# EAGLE schematic headstage-64_bga (EAGLE 8.3.2)
DESIGNER: JON NEWMAN, JAKOB VOIGTS, JACK ZHANG; LICENSE: CC-BY-SA-4.0; REVISION: 1.0
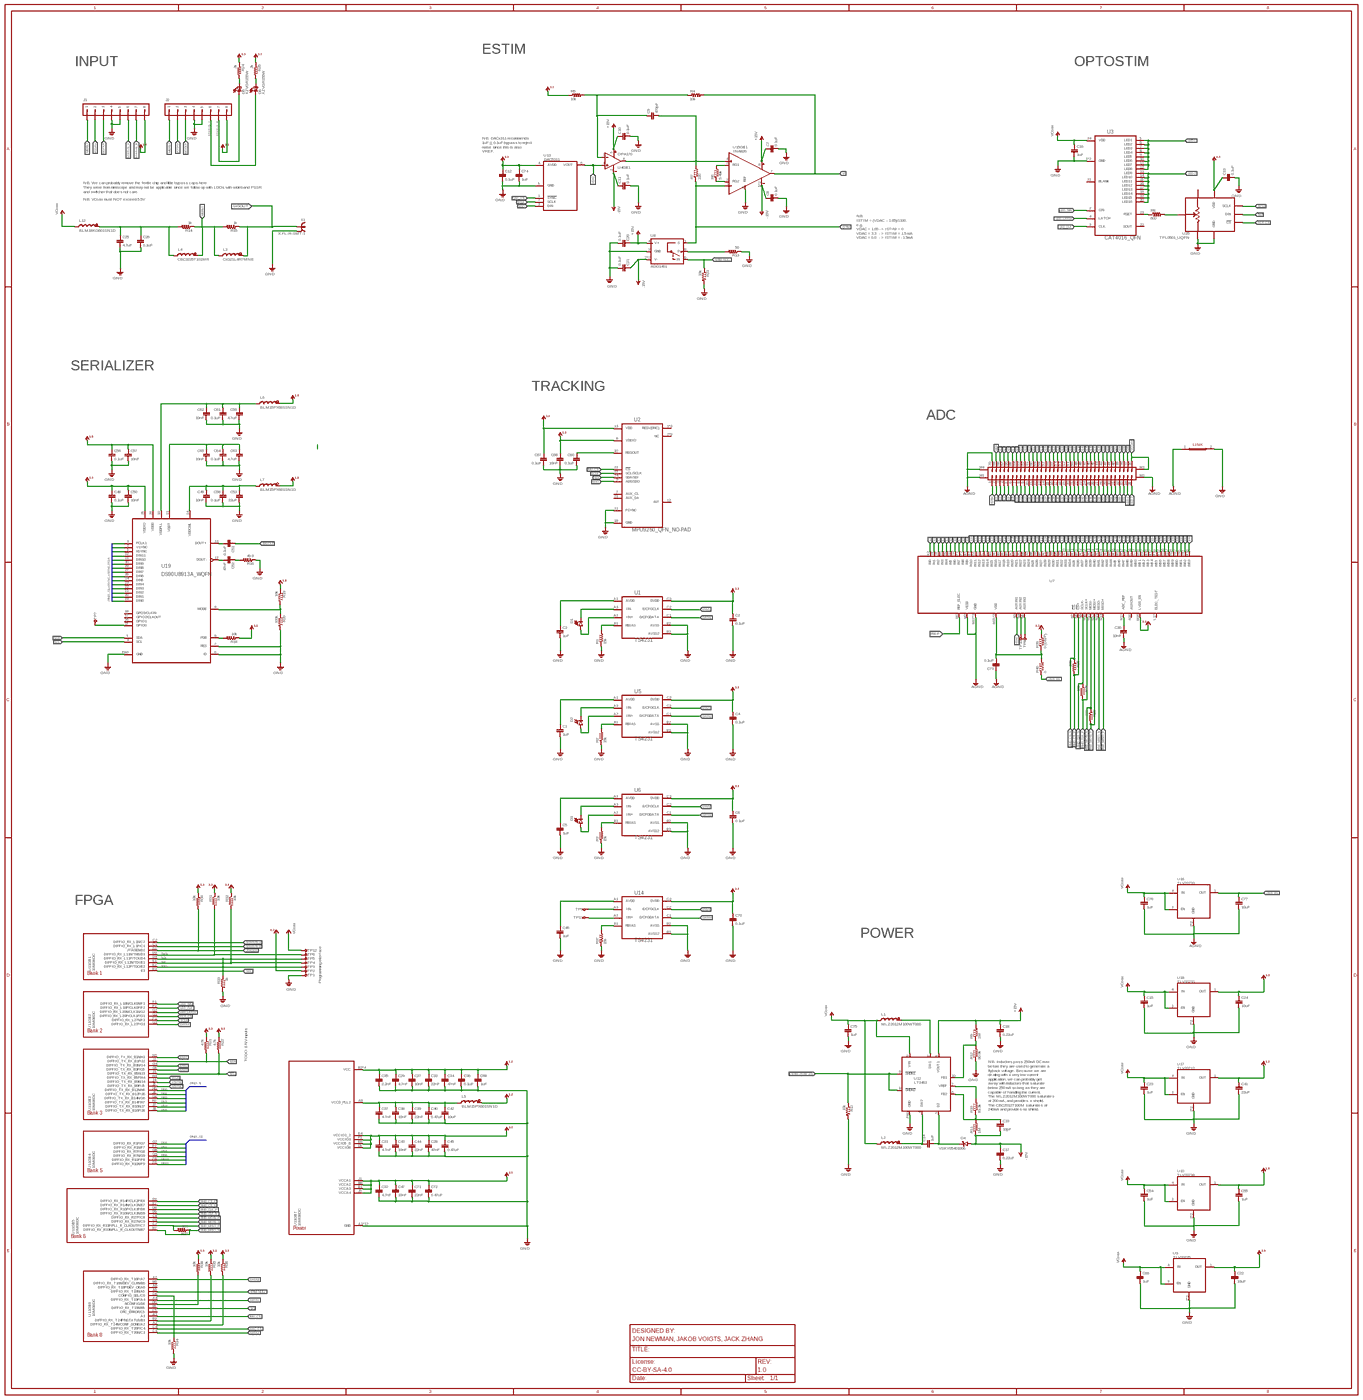
[diagram p0: schematic, sheet 1, overview]
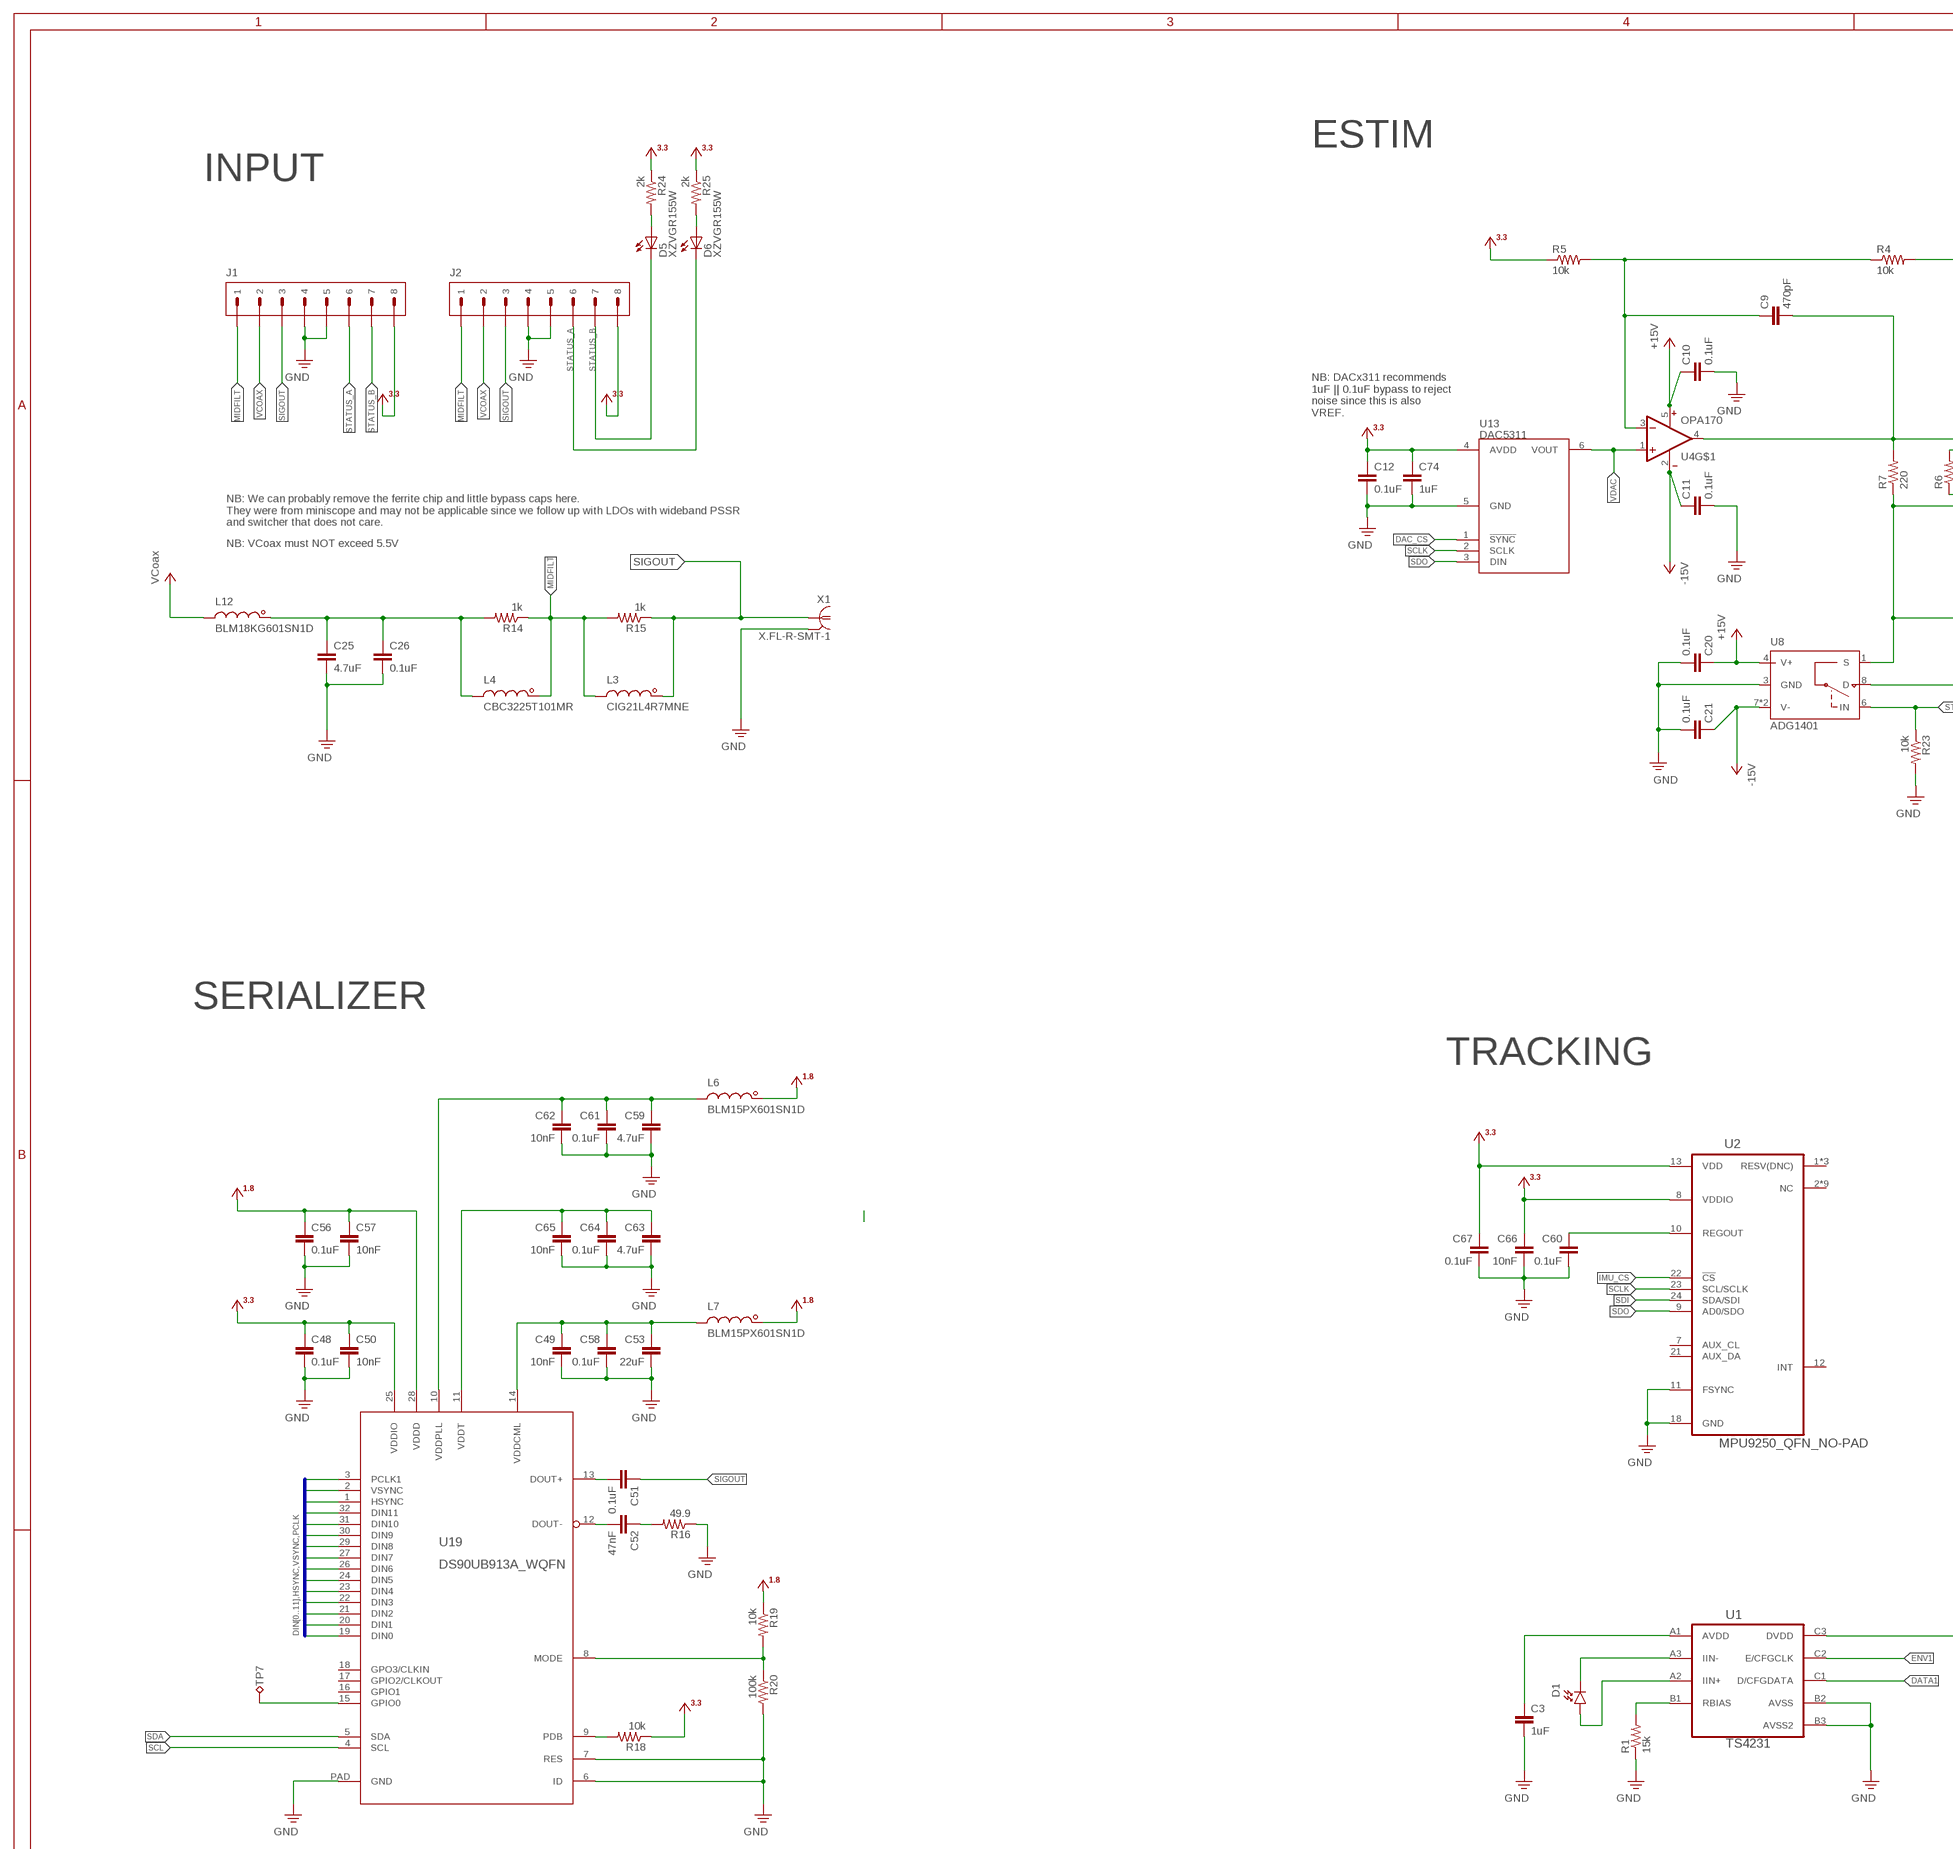
[diagram p1: schematic, sheet 1, part 1 of 4]
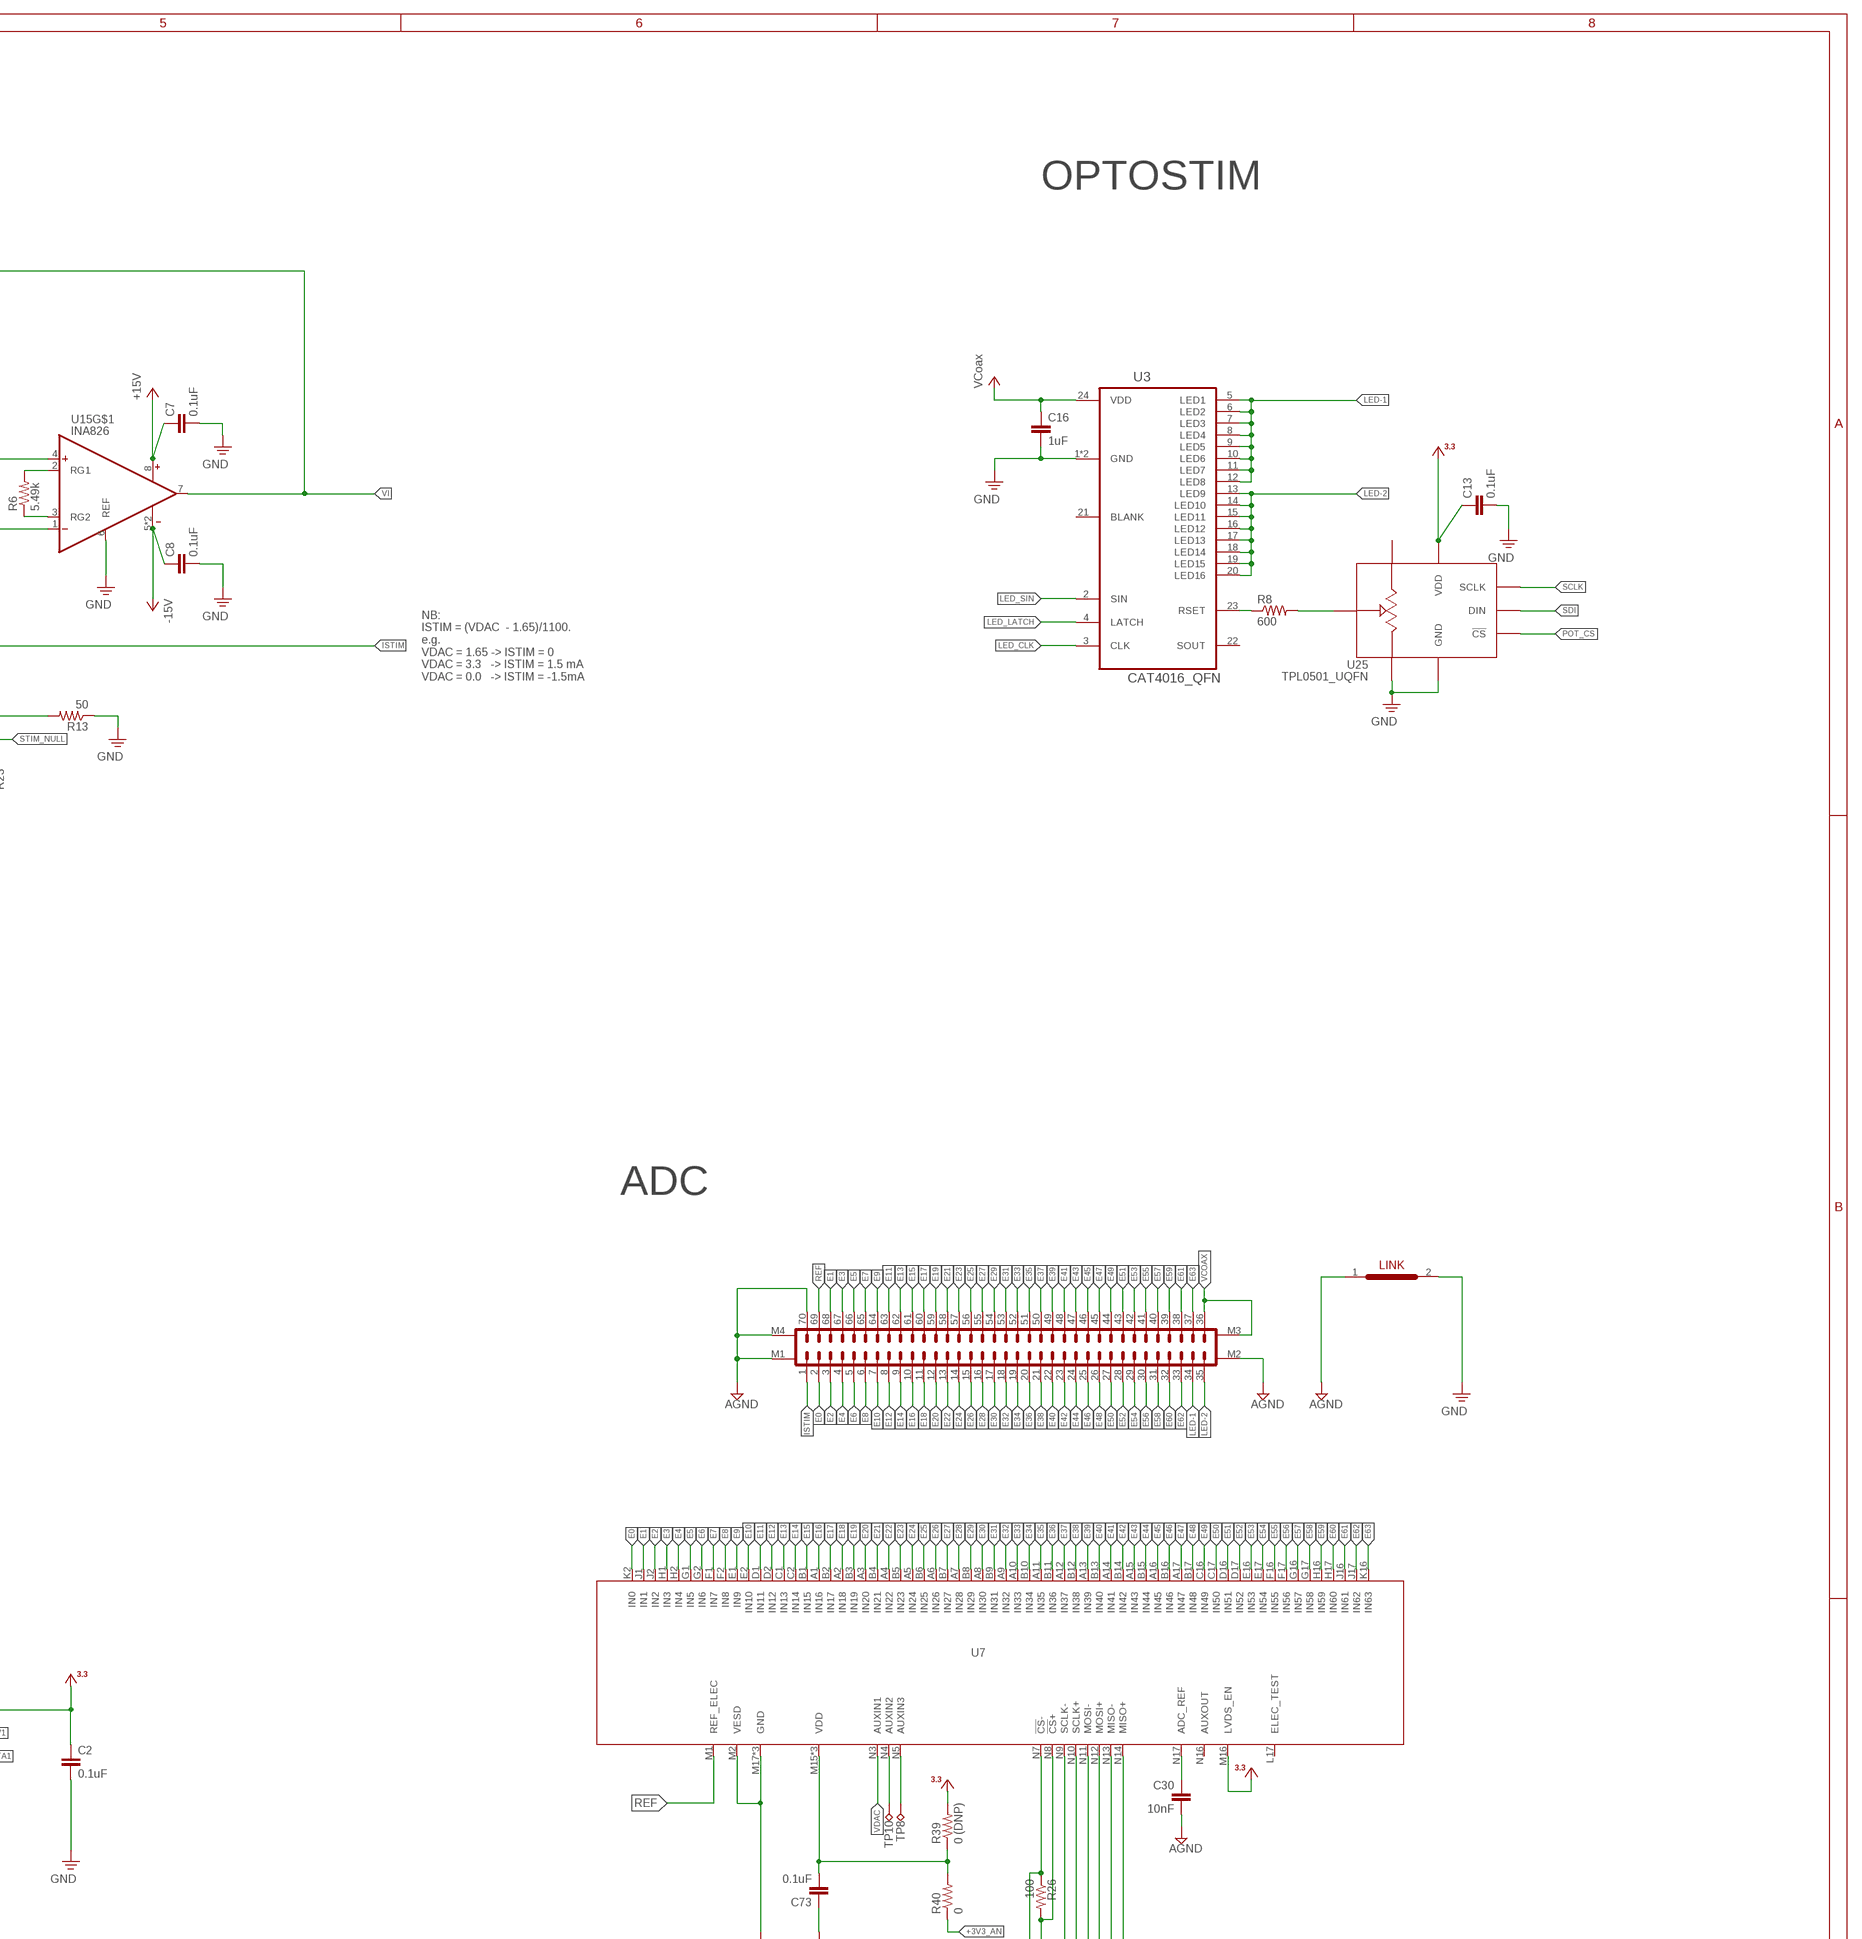
[diagram p2: schematic, sheet 1, part 2 of 4]
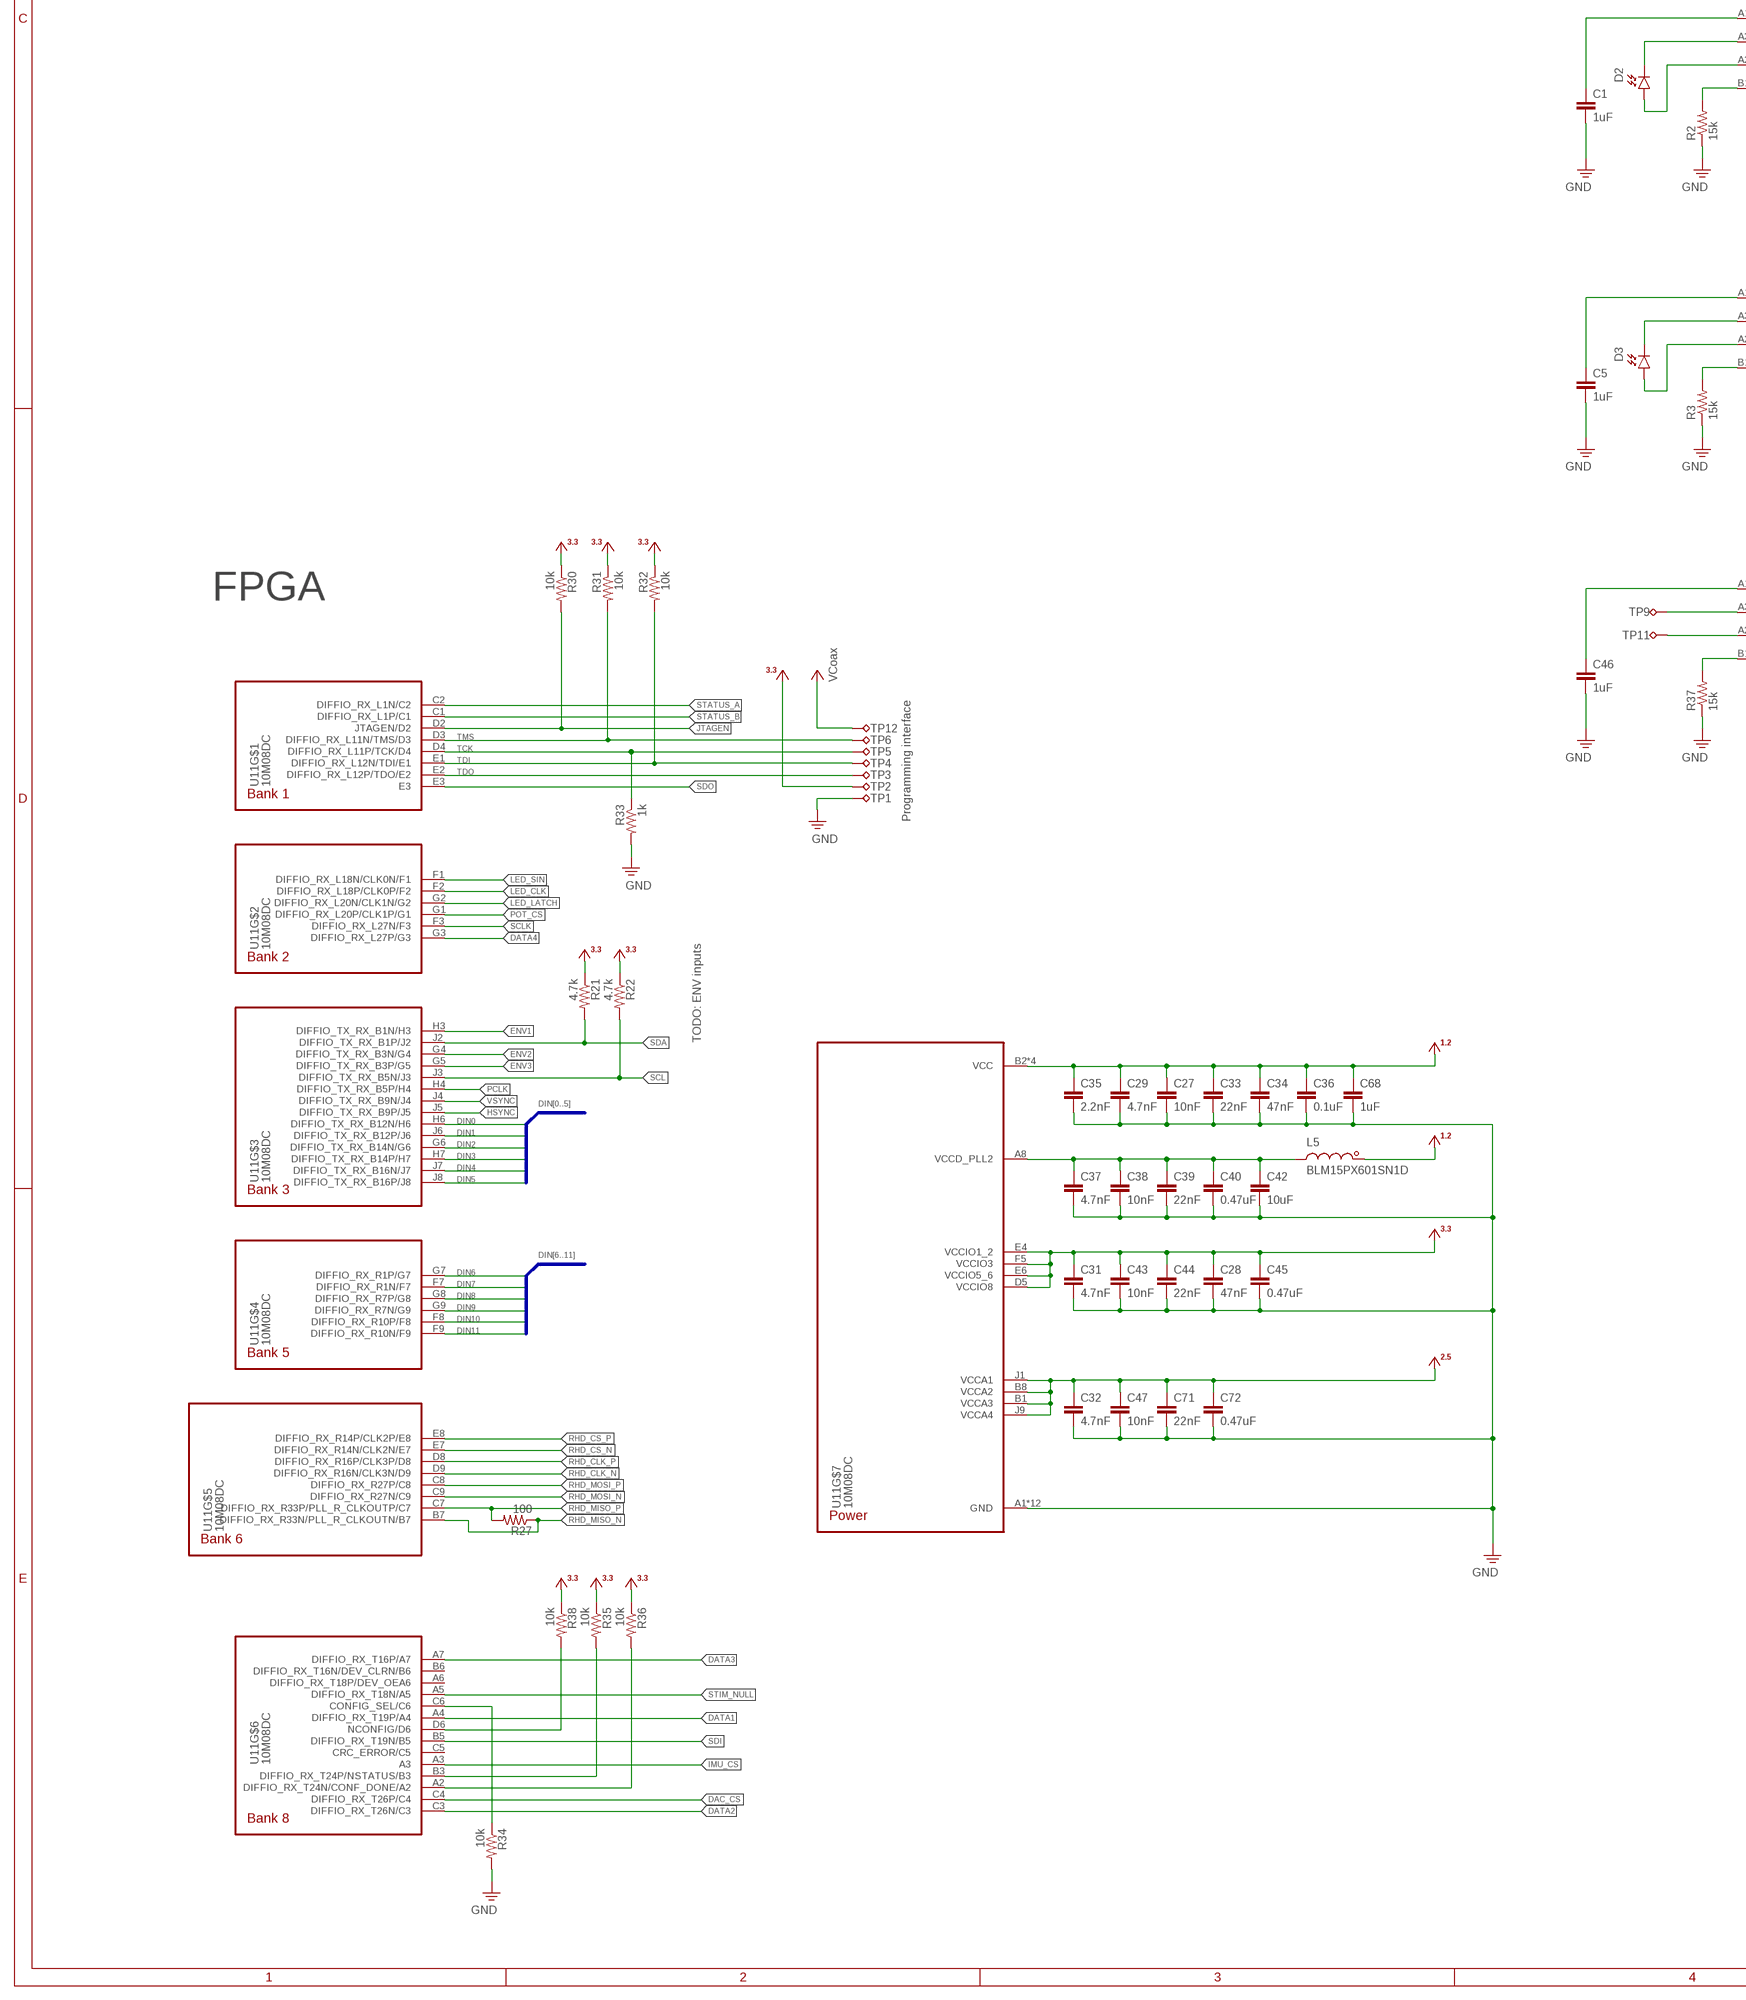
[diagram p3: schematic, sheet 1, part 3 of 4]
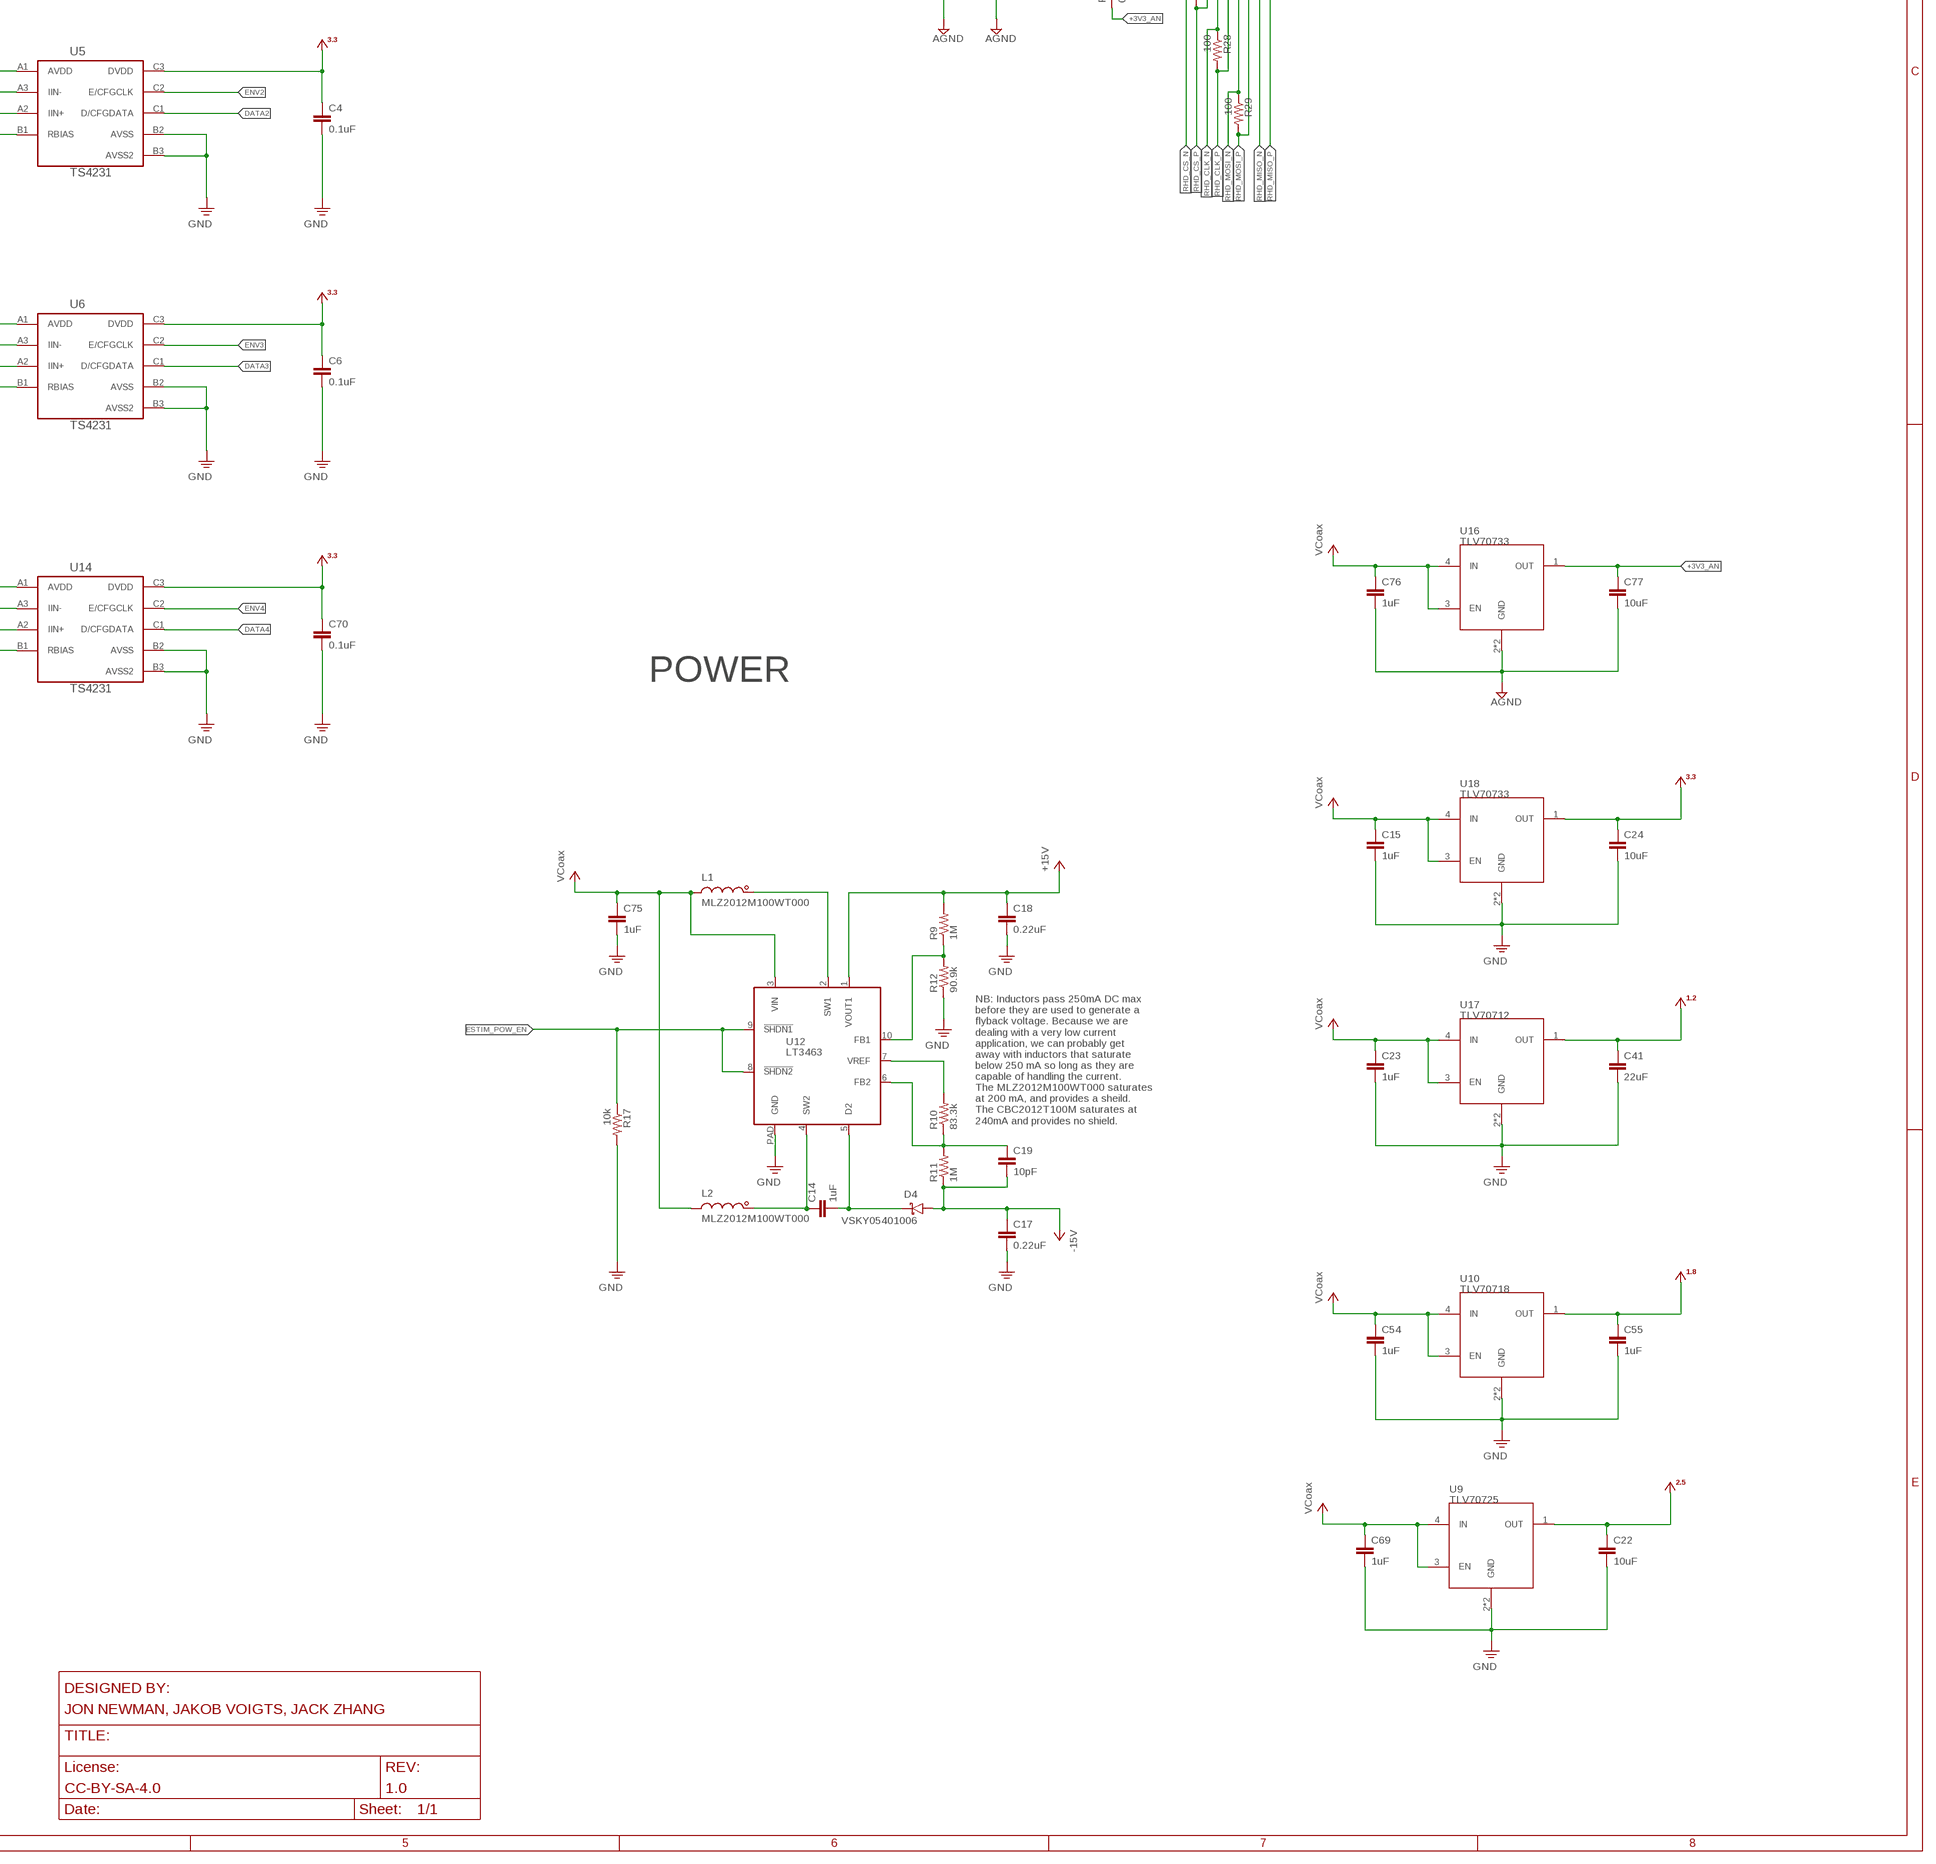
[diagram p4: schematic, sheet 1, part 4 of 4]

## Parts
C1  1uF  C_0201T  [0201T]
C2  0.1uF  C_0201T  [0201T]
C3  1uF  C_0201T  [0201T]
C4  0.1uF  C_0201T  [0201T]
C5  1uF  C_0201T  [0201T]
C6  0.1uF  C_0201T  [0201T]
C7  0.1uF  C_0201T  [0201T]
C8  0.1uF  C_0201T  [0201T]
C9  470pF  C_0201T  [0201T]
C10  0.1uF  C_0201T  [0201T]
C11  0.1uF  C_0201T  [0201T]
C12  0.1uF  C_0201T  [0201T]
C13  0.1uF  C_0201T  [0201T]
C14  1uF  C_0402T  [0402T]
C15  1uF  C_0402T  [0402T]
C16  1uF  C_0402T  [0402T]
C17  0.22uF  C_0402T  [0402T]
C18  0.22uF  C_0402T  [0402T]
C19  10pF  C_0201T  [0201T]
C20  0.1uF  C_0201T  [0201T]
C21  0.1uF  C_0201T  [0201T]
C22  10uF  C_0402T  [0402T]
C23  1uF  C_0402T  [0402T]
C24  10uF  C_0402T  [0402T]
C25  4.7uF  C_0402T  [0402T]
C26  0.1uF  C_0402T  [0402T]
C27  10nF  C_0201T  [0201T]
C28  47nF  C_0201T  [0201T]
C29  4.7nF  C_0201T  [0201T]
C30  10nF  C_0201T  [0201T]
C31  4.7nF  C_0201T  [0201T]
C32  4.7nF  C_0201T  [0201T]
C33  22nF  C_0201T  [0201T]
C34  47nF  C_0201T  [0201T]
C35  2.2nF  C_0201T  [0201T]
C36  0.1uF  C_0201T  [0201T]
C37  4.7nF  C_0201T  [0201T]
C38  10nF  C_0201T  [0201T]
C39  22nF  C_0201T  [0201T]
C40  0.47uF  C_0201T  [0201T]
C41  22uF  C_0402T  [0402T]
C42  10uF  C_0402T  [0402T]
C43  10nF  C_0201T  [0201T]
C44  22nF  C_0201T  [0201T]
C45  0.47uF  C_0201T  [0201T]
C46  1uF  C_0201T  [0201T]
C47  10nF  C_0201T  [0201T]
C48  0.1uF  C_0201T  [0201T]
C49  10nF  C_0201T  [0201T]
C50  10nF  C_0201T  [0201T]
C51  0.1uF  C_0201T  [0201T]
C52  47nF  C_0201T  [0201T]
C53  22uF  C_0402T  [0402T]
C54  1uF  C_0402T  [0402T]
C55  1uF  C_0201T  [0201T]
C56  0.1uF  C_0201T  [0201T]
C57  10nF  C_0201T  [0201T]
C58  0.1uF  C_0201T  [0201T]
C59  4.7uF  C_0402T  [0402T]
C60  0.1uF  C_0201T  [0201T]
C61  0.1uF  C_0201T  [0201T]
C62  10nF  C_0201T  [0201T]
C63  4.7uF  C_0402T  [0402T]
C64  0.1uF  C_0201T  [0201T]
C65  10nF  C_0201T  [0201T]
C66  10nF  C_0201T  [0201T]
C67  0.1uF  C_0201T  [0201T]
C68  1uF  C_0201T  [0201T]
C69  1uF  C_0402T  [0402T]
C70  0.1uF  C_0201T  [0201T]
C71  22nF  C_0201T  [0201T]
C72  0.47uF  C_0201T  [0201T]
C73  0.1uF  C_0201T  [0201T]
C74  1uF  C_0201T  [0201T]
C75  1uF  C_0402T  [0402T]
C76  1uF  C_0402T  [0402T]
C77  10uF  C_0402T  [0402T]
D1  PHOTODIODE_0805T  [0805T]
D2  PHOTODIODE_0805T  [0805T]
D3  PHOTODIODE_0805T  [0805T]
D4  VSKY05401006  S-DIODE_0402T  [0402T]
D5  XZVGR155W  LED_0201T  [LED-0201T]
D6  XZVGR155W  LED_0201T  [LED-0201T]
J1  HEADSTAGE64_EDGE-MOUNT  [HEADSTAGE64-EDGE-MOUNT_PADS]
J2  HEADSTAGE64_EDGE-MOUNT_CASTELLATED  [HEADSTAGE64-EDGE-MOUNT_CASTELLATED]
J3  GND_LINK_0201  [0201_LINK]
L1  MLZ2012M100WT000  L_0805T  [0805T]
L2  MLZ2012M100WT000  L_0805T  [0805T]
L3  CIG21L4R7MNE  L_0805T  [0805T]
L4  CBC3225T101MR  L_1210T  [1210T]
L5  BLM15PX601SN1D  L_0402T  [0402T]
L6  BLM15PX601SN1D  L_0402T  [0402T]
L7  BLM15PX601SN1D  L_0402T  [0402T]
L12  BLM18KG601SN1D  L_0603T  [0603T]
R1  15k  R_0201T  [0201T]
R2  15k  R_0201T  [0201T]
R3  15k  R_0201T  [0201T]
R4  10k  R_0201T  [0201T]
R5  10k  R_0201T  [0201T]
R6  5.49k  R_0201T  [0201T]
R7  220  R_0201T  [0201T]
R8  600  R_0201T  [0201T]
R9  1M  R_0201T  [0201T]
R10  83.3k  R_0201T  [0201T]
R11  1M  R_0201T  [0201T]
R12  90.9k  R_0201T  [0201T]
R13  50  R_0201T  [0201T]
R14  1k  R_0201T  [0201T]
R15  1k  R_0201T  [0201T]
R16  49.9  R_0201T  [0201T]
R17  10k  R_0201T  [0201T]
R18  10k  R_0201T  [0201T]
R19  10k  R_0201T  [0201T]
R20  100k  R_0201T  [0201T]
R21  4.7k  R_0201T  [0201T]
R22  4.7k  R_0201T  [0201T]
R23  10k  R_0201T  [0201T]
R24  2k  R_0201T  [0201T]
R25  2k  R_0201T  [0201T]
R26  100  R_0201T  [0201T]
R27  100  R_0201T  [0201T]
R28  100  R_0201T  [0201T]
R29  100  R_0201T  [0201T]
R30  10k  R_0201T  [0201T]
R31  10k  R_0201T  [0201T]
R32  10k  R_0201T  [0201T]
R33  1k  R_0201T  [0201T]
R34  10k  R_0201T  [0201T]
R35  10k  R_0201T  [0201T]
R36  10k  R_0201T  [0201T]
R37  15k  R_0201T  [0201T]
R38  10k  R_0201T  [0201T]
R39  0 (DNP)  R_0201T  [0201T]
R40  0  R_0201T  [0201T]
TP1  VCC  TPB0.4MM  [B0.4MM]
TP2  gnd  TPB0.4MM  [B0.4MM]
TP3  TPB0.4MM  [B0.4MM]
TP4  TPB0.4MM  [B0.4MM]
TP5  TPB0.4MM  [B0.4MM]
TP6  TPB0.4MM  [B0.4MM]
TP7  TPTP06R  [TP06R]
TP8  VCC  TPB0.3MM  [B0.3MM]
TP9  TPTP06R  [TP06R]
TP10  VCC  TPB0.3MM  [B0.3MM]
TP11  TPTP06R  [TP06R]
TP12  TPB0.4MM  [B0.4MM]
U1  TS4231  [WLCSP3X3]
U2  MPU9250_QFN_NO-PAD  [QFN24-3X3_NO-PAD]
U3  CAT4016_QFN  [QFN24-4X4]
U4  OPA170  OPAMP_PDSO  [PDSO-N5]
U5  TS4231  [WLCSP3X3]
U6  TS4231  [WLCSP3X3]
U7  RHD2164_BGA_BGA  [BGA104_0.5MM]
U8  ADG1401  ADG140X_LFCSP  [LFCSP8-2X3]
U9  TLV70725  TLV707  [X2SON]
U10  TLV70718  TLV707  [X2SON]
U11  10M08DC  10M08DC_VBGA  [VBGA81-4X4]
U12  LT3463  [DFN103X3]
U13  DAC5311  [SC70]
U14  TS4231  [WLCSP3X3]
U15  INA826  INSTRUMENTAMP_PWSON  [PWSON-N8-3X3]
U16  TLV70733  TLV707  [X2SON]
U17  TLV70712  TLV707  [X2SON]
U18  TLV70733  TLV707  [X2SON]
U19  DS90UB913A_WQFN  [WQFN32-5X5]
U25  TPL0501_UQFN  [UQFN]
U$1  PINHD-2X35+4_DF40-70HEAD  [DF40-70HEAD]
X1  X.FL-R-SMT-1  COAX_XFL  [X_FL_R_SMT_1(02)]

## Nets
$N324: C37.1 C38.1 C39.1 C40.1 C42.1 L5.2 U11.A8(VCCD_PLL2)
+1V2: C27.1 C29.1 C33.1 C34.1 C35.1 C36.1 C41.1 C68.1 L5.1 U11.B2(VCC) U11.B9(VCC) U11.H2(VCC) U11.H8(VCC) U17.1(OUT)
+1V8: C55.1 C56.1 C57.1 L6.1 L7.1 R19.1 U10.1(OUT) U19.28(VDDD)
+2V5: C22.1 C32.1 C47.1 C71.1 C72.1 U9.1(OUT) U11.B1(VCCA3) U11.B8(VCCA2) U11.J1(VCCA1) U11.J9(VCCA4)
+3V3: C2.1 C4.1 C6.1 C12.1 C13.1 C24.1 C28.1 C31.1 C43.1 C44.1 C45.1 C48.1 C50.1 C66.1 C67.1 C70.1 C74.1 J1.8 J2.8 R5.1 R18.1 R21.1 R22.1 R24.1 R25.1 R30.1 R31.1 R32.1 R35.1 R36.1 R38.1 R39.2 TP2.TP U1.C3(DVDD) U2.8(VDDIO) U2.13(VDD) U5.C3(DVDD) U6.C3(DVDD) U7.M16(LVDS_EN) U11.D5(VCCIO8) U11.E4(VCCIO1_2) U11.E6(VCCIO5_6) U11.F5(VCCIO3) U13.4(AVDD) U14.C3(DVDD) U18.1(OUT) U19.25(VDDIO) U25.P$7(VDD)
+3V3_AN: C77.1 R40.1 U16.1(OUT)
AGND: C30.2 C73.1 C76.2 C77.2 J3.1 U7.M2(VESD) U7.M17(GND) U7.N1(GND) U7.N6(GND) U16.2(GND) U16.5(GND) U$1.70 U$1.M1 U$1.M2 U$1.M4
AUXIN2: TP10.TP U7.N4(AUXIN2)
AUXIN3: TP8.TP U7.N5(AUXIN3)
CONF_DONE: R36.2 U11.A2(DIFFIO_RX_T24N/CONF_DONE/A2)
CONFIG_SEL: R34.1 U11.C6(CONFIG_SEL/C6)
DAC_CS: U11.C4(DIFFIO_RX_T26P/C4) U13.1(!SYNC)
DATA1: U1.C1(D/CFGDATA) U11.A4(DIFFIO_RX_T19P/A4)
DATA2: U5.C1(D/CFGDATA) U11.C3(DIFFIO_RX_T26N/C3)
DATA3: U6.C1(D/CFGDATA) U11.A7(DIFFIO_RX_T16P/A7)
DATA4: U11.G3(DIFFIO_RX_L27P/G3) U14.C1(D/CFGDATA)
DIN0: U11.H6(DIFFIO_TX_RX_B12N/H6) U19.19(DIN0)
DIN1: U11.J6(DIFFIO_TX_RX_B12P/J6) U19.20(DIN1)
DIN2: U11.G6(DIFFIO_TX_RX_B14N/G6) U19.21(DIN2)
DIN3: U11.H7(DIFFIO_TX_RX_B14P/H7) U19.22(DIN3)
DIN4: U11.J7(DIFFIO_TX_RX_B16N/J7) U19.23(DIN4)
DIN5: U11.J8(DIFFIO_TX_RX_B16P/J8) U19.24(DIN5)
DIN6: U11.G7(DIFFIO_RX_R1P/G7) U19.26(DIN6)
DIN7: U11.F7(DIFFIO_RX_R1N/F7) U19.27(DIN7)
DIN8: U11.G8(DIFFIO_RX_R7P/G8) U19.29(DIN8)
DIN9: U11.G9(DIFFIO_RX_R7N/G9) U19.30(DIN9)
DIN10: U11.F8(DIFFIO_RX_R10P/F8) U19.31(DIN10)
DIN11: U11.F9(DIFFIO_RX_R10N/F9) U19.32(DIN11)
E0: U7.K2(IN0) U$1.2
E1: U7.J1(IN1) U$1.68
E2: U7.J2(IN2) U$1.3
E3: U7.H1(IN3) U$1.67
E4: U7.H2(IN4) U$1.4
E5: U7.G1(IN5) U$1.66
E6: U7.G2(IN6) U$1.5
E7: U7.F1(IN7) U$1.65
E8: U7.F2(IN8) U$1.6
E9: U7.E1(IN9) U$1.64
E10: U7.E2(IN10) U$1.7
E11: U7.D1(IN11) U$1.63
E12: U7.D2(IN12) U$1.8
E13: U7.C1(IN13) U$1.62
E14: U7.C2(IN14) U$1.9
E15: U7.B1(IN15) U$1.61
E16: U7.A1(IN16) U$1.10
E17: U7.B2(IN17) U$1.60
E18: U7.A2(IN18) U$1.11
E19: U7.B3(IN19) U$1.59
E20: U7.A3(IN20) U$1.12
E21: U7.B4(IN21) U$1.58
E22: U7.A4(IN22) U$1.13
E23: U7.B5(IN23) U$1.57
E24: U7.A5(IN24) U$1.14
E25: U7.B6(IN25) U$1.56
E26: U7.A6(IN26) U$1.15
E27: U7.B7(IN27) U$1.55
E28: U7.A7(IN28) U$1.16
E29: U7.B8(IN29) U$1.54
E30: U7.A8(IN30) U$1.17
E31: U7.B9(IN31) U$1.53
E32: U7.A9(IN32) U$1.18
E33: U7.A10(IN33) U$1.52
E34: U7.B10(IN34) U$1.19
E35: U7.A11(IN35) U$1.51
E36: U7.B11(IN36) U$1.20
E37: U7.A12(IN37) U$1.50
E38: U7.B12(IN38) U$1.21
E39: U7.A13(IN39) U$1.49
E40: U7.B13(IN40) U$1.22
E41: U7.A14(IN41) U$1.48
E42: U7.B14(IN42) U$1.23
E43: U7.A15(IN43) U$1.47
E44: U7.B15(IN44) U$1.24
E45: U7.A16(IN45) U$1.46
E46: U7.B16(IN46) U$1.25
E47: U7.A17(IN47) U$1.45
E48: U7.B17(IN48) U$1.26
E49: U7.C16(IN49) U$1.44
E50: U7.C17(IN50) U$1.27
E51: U7.D16(IN51) U$1.43
E52: U7.D17(IN52) U$1.28
E53: U7.E16(IN53) U$1.42
E54: U7.E17(IN54) U$1.29
E55: U7.F16(IN55) U$1.41
E56: U7.F17(IN56) U$1.30
E57: U7.G16(IN57) U$1.40
E58: U7.G17(IN58) U$1.31
E59: U7.H16(IN59) U$1.39
E60: U7.H17(IN60) U$1.32
E61: U7.J16(IN61) U$1.38
E62: U7.J17(IN62) U$1.33
E63: U7.K16(IN63) U$1.37
ENV1: U1.C2(E/CFGCLK) U11.H3(DIFFIO_TX_RX_B1N/H3)
ENV2: U5.C2(E/CFGCLK) U11.G4(DIFFIO_TX_RX_B3N/G4)
ENV3: U6.C2(E/CFGCLK) U11.G5(DIFFIO_TX_RX_B3P/G5)
ENV4: U14.C2(E/CFGCLK)
ESTIM_POW_EN: R17.1 U12.8(!SHDN2) U12.9(!SHDN1)
GND: C1.2 C2.2 C3.2 C4.2 C5.2 C6.2 C7.2 C8.2 C10.2 C11.2 C12.2 C13.2 C15.2 C16.2 C17.2 C18.2 C20.2 C21.2 C22.2 C23.2 C24.2 C25.2 C26.2 C27.2 C28.2 C29.2 C31.2 C32.2 C33.2 C34.2 C35.2 C36.2 C37.2 C38.2 C39.2 C40.2 C41.2 C42.2 C43.2 C44.2 C45.2 C46.2 C47.2 C48.2 C49.2 C50.2 C53.2 C54.2 C55.2 C56.2 C57.2 C58.2 C59.2 C60.2 C61.2 C62.2 C63.2 C64.2 C65.2 C66.2 C67.2 C68.2 C69.2 C70.2 C71.2 C72.2 C74.2 C75.2 J1.4 J1.5 J2.4 J2.5 J3.2 R1.1 R2.1 R3.1 R12.1 R13.1 R16.1 R17.2 R20.2 R23.2 R33.2 R34.2 R37.1 TP1.TP U1.B2(AVSS) U1.B3(AVSS2) U2.11(FSYNC) U2.18(GND) U3.1(GND) U3.PAD(GND) U5.B2(AVSS) U5.B3(AVSS2) U6.B2(AVSS) U6.B3(AVSS2) U8.3(GND) U9.2(GND) U9.5(GND) U10.2(GND) U10.5(GND) U11.A1(GND) U11.A9(GND) U11.B4(GND) U11.D1(GND) U11.D7(GND) U11.E5(GND) U11.E9(GND) U11.F4(GND) U11.F6(GND) U11.H1(GND) U11.H5(GND) U11.H9(GND) U12.PAD(GND) U13.5(GND) U14.B2(AVSS) U14.B3(AVSS2) U15.6(REF) U17.2(GND) U17.5(GND) U18.2(GND) U18.5(GND) U19.6(ID) U19.7(RES) U19.PAD(GND) U25.P$4(GND) U25.P$8(LA) X1.P$2 X1.P$3 X1.P$4
GPO0: TP7.TP U19.15(GPIO0)
HSYNC: U11.J5(DIFFIO_TX_RX_B9P/J5) U19.1(HSYNC)
IMU_CS: U2.22(!CS) U11.A3
INTAN_VDD: C73.2 R39.1 R40.2 U7.M15(VDD) U7.N2(VDD) U7.N15(VDD)
ISTIM: R7.1 U8.1(S) U15.1(-IN) U$1.1
JTAGEN: R30.2 U11.D2(JTAGEN/D2)
LED-1: U3.5(LED1) U3.6(LED2) U3.7(LED3) U3.8(LED4) U3.9(LED5) U3.10(LED6) U3.11(LED7) U3.12(LED8) U$1.34
LED-2: U3.13(LED9) U3.14(LED10) U3.15(LED11) U3.16(LED12) U3.17(LED13) U3.18(LED14) U3.19(LED15) U3.20(LED16) U$1.35
LED_CLK: U3.3(CLK) U11.F2(DIFFIO_RX_L18P/CLK0P/F2)
LED_LATCH: U3.4(LATCH) U11.G2(DIFFIO_RX_L20N/CLK1N/G2)
LED_SIN: U3.2(SIN) U11.F1(DIFFIO_RX_L18N/CLK0N/F1)
MIDFILT: J1.1 J2.1 L3.2 L4.1 R14.1 R15.2
N$1: R8.2 U25.P$6(WA)
N$2: C14.1 L2.1 U12.4(SW2)
N$3: C19.1 R10.1 R11.2 U12.6(FB2)
N$4: D1.2(C) U1.A3(IIN-)
N$5: D1.1(A) U1.A2(IIN+)
N$6: R1.2 U1.B1(RBIAS)
N$7: C3.1 U1.A1(AVDD)
N$8: L1.1 U12.2(SW1)
N$9: D2.2(C) U5.A3(IIN-)
N$10: D2.1(A) U5.A2(IIN+)
N$11: R2.2 U5.B1(RBIAS)
N$12: C1.1 U5.A1(AVDD)
N$13: C25.1 C26.1 L4.2 L12.1 R14.2
N$14: R8.1 U3.23(RSET)
N$15: D3.2(C) U6.A3(IIN-)
N$16: D3.1(A) U6.A2(IIN+)
N$17: R3.2 U6.B1(RBIAS)
N$18: C5.1 U6.A1(AVDD)
N$19: C14.2 D4.2(C) U12.5(D2)
N$20: R6.2 U15.2(RG1)
N$21: R6.1 U15.3(RG2)
N$22: C9.2 R7.2 U4.4(OUT) U15.4(+IN)
N$23: R13.2 U8.8(D)
N$24: R9.1 R12.2 U12.10(FB1)
N$25: C9.1 R4.1 R5.2 U4.3(-IN)
N$26: TP9.TP U14.A3(IIN-)
N$27: R10.2 U12.7(VREF)
N$28: C51.2 U19.13(DOUT+)
N$29: D5.2(A) R24.2
N$30: R18.2 U19.9(PDB)
N$31: C52.2 U19.12(DOUT-)
N$32: C52.1 R16.2
N$33: R19.2 R20.1 U19.8(MODE)
N$34: C59.1 C61.1 C62.1 L6.2 U19.10(VDDPLL)
N$35: C49.1 C53.1 C58.1 L7.2 U19.14(VDDCML)
N$36: C30.1 U7.N17(ADC_REF)
N$37: C63.1 C64.1 C65.1 U19.11(VDDT)
N$38: TP11.TP U14.A2(IIN+)
N$39: D6.2(A) R25.2
N$40: C60.1 U2.10(REGOUT)
N$41: R37.2 U14.B1(RBIAS)
N$42: C46.1 U14.A1(AVDD)
N$45: R38.2 U11.D6(NCONFIG/D6)
NSTATUS: R35.2 U11.B3(DIFFIO_RX_T24P/NSTATUS/B3)
PCLK: U11.H4(DIFFIO_TX_RX_B5P/H4) U19.3(PCLK1)
POT_CS: U11.G1(DIFFIO_RX_L20P/CLK1P/G1) U25.P$3(!CS)
REF: U7.M1(REF_ELEC) U$1.69
RHD_CLK_N: R28.1 U7.N9(SCLK-) U11.D9(DIFFIO_RX_R16N/CLK3N/D9)
RHD_CLK_P: R28.2 U7.N10(SCLK+) U11.D8(DIFFIO_RX_R16P/CLK3P/D8)
RHD_CS_N: R26.1 U7.N7(!CS!-) U11.E7(DIFFIO_RX_R14N/CLK2N/E7)
RHD_CS_P: R26.2 U7.N8(!CS!+) U11.E8(DIFFIO_RX_R14P/CLK2P/E8)
RHD_MISO_N: R27.1 U7.N13(MISO-) U11.B7(DIFFIO_RX_R33N/PLL_R_CLKOUTN/B7)
RHD_MISO_P: R27.2 U7.N14(MISO+) U11.C7(DIFFIO_RX_R33P/PLL_R_CLKOUTP/C7)
RHD_MOSI_N: R29.1 U7.N11(MOSI-) U11.C9(DIFFIO_RX_R27N/C9)
RHD_MOSI_P: R29.2 U7.N12(MOSI+) U11.C8(DIFFIO_RX_R27P/C8)
SCL: R22.2 U11.J3(DIFFIO_TX_RX_B5N/J3) U19.4(SCL)
SCLK: U2.23(SCL/SCLK) U11.F3(DIFFIO_RX_L27N/F3) U13.2(SCLK) U25.P$5(SCLK)
SDA: R21.2 U11.J2(DIFFIO_TX_RX_B1P/J2) U19.5(SDA)
SDI: U2.24(SDA/SDI) U11.B5(DIFFIO_RX_T19N/B5) U25.P$2(DIN)
SDO: U2.9(AD0/SDO) U11.E3 U13.3(DIN)
SIGOUT: C51.1 J1.3 J2.3 L3.1 R15.1 X1.P$1
STATUS_A: D6.1(C) J1.6 J2.6 U11.C2(DIFFIO_RX_L1N/C2)
STATUS_B: D5.1(C) J1.7 J2.7 U11.C1(DIFFIO_RX_L1P/C1)
STIM_NULL: R23.1 U8.6(IN) U11.A5(DIFFIO_RX_T18N/A5)
TCK: R33.1 TP5.TP U11.D4(DIFFIO_RX_L11P/TCK/D4)
TDI: R32.2 TP4.TP U11.E1(DIFFIO_RX_L12N/TDI/E1)
TDO: TP3.TP U11.E2(DIFFIO_RX_L12P/TDO/E2)
TMS: R31.2 TP6.TP U11.D3(DIFFIO_RX_L11N/TMS/D3)
V+: C7.1 C10.1 C18.1 C20.1 R9.2 U4.5(V+) U8.4(V+) U12.1(VOUT1) U15.8(V+) ; supply symbol labelled +15V
V-: C8.1 C11.1 C17.1 C19.2 C21.1 D4.1(A) R11.1 U4.2(V-) U8.7(V-) U8.PAD(V-) U15.5(V-) U15.PAD(V-) ; supply symbol labelled -15V
VCOAX: C15.1 C16.1 C23.1 C54.1 C69.1 C75.1 C76.1 J1.2 J2.2 L1.2 L2.2 L12.2 TP12.TP U3.24(VDD) U9.3(EN) U9.4(IN) U10.3(EN) U10.4(IN) U12.3(VIN) U16.3(EN) U16.4(IN) U17.3(EN) U17.4(IN) U18.3(EN) U18.4(IN) U$1.36 U$1.M3 ; supply symbol labelled VCoax
VDAC: U4.1(+IN) U7.N3(AUXIN1) U13.6(VOUT)
VI: R4.2 U15.7(OUT)
VSYNC: U11.J4(DIFFIO_TX_RX_B9N/J4) U19.2(VSYNC)
Unconnected: U2.1(RESV(DNC)) U2.2(NC) U2.3(NC) U2.4(NC) U2.5(NC) U2.6(NC) U2.7(AUX_CL) U2.12(INT) U2.14(NC) U2.15(NC) U2.16(NC) U2.17(NC) U2.19(RESV(DNC)) U2.20(RESV(DNC)) U2.21(AUX_DA) U3.21(BLANK) U3.22(SOUT) U7.L17(ELEC_TEST) U7.N16(AUXOUT) U11.A6(DIFFIO_RX_T18P/DEV_OEA6) U11.B6(DIFFIO_RX_T16N/DEV_CLRN/B6) U11.C5(CRC_ERROR/C5) U19.16(GPIO1) U19.17(GPIO2/CLKOUT) U19.18(GPO3/CLKIN) U25.P$1(HA)

## Buses
DIN[0..11],HSYNC,VSYNC,PCLK
DIN[0..5]
DIN[6..11]

## Notes on the sheet
- ESTIM
- INPUT | OPTOSTIM
- NB: DACx311 recommends
  1uF || 0.1uF bypass to reject 
  noise since this is also 
  VREF.
- NB: We can probably remove the ferrite chip and little bypass caps here. 
  They were from miniscope and may not be applicable since we follow up with LDOs with wideband PSSR 
  and switcher that does not care.
- NB: VCoax must NOT exceed 5.5V
- NB:
  ISTIM = (VDAC  - 1.65)/1100.
  e.g. 
  VDAC = 1.65 -> ISTIM = 0
  VDAC = 3.3   -> ISTIM = 1.5 mA
  VDAC = 0.0   -> ISTIM = -1.5mA
- SERIALIZER
- TRACKING
- ADC
- FPGA
- POWER
- Programming interface
- TODO: ENV inputs
- NB: Inductors pass 250mA DC max
  before they are used to generate a
  flyback voltage. Because we are
  dealing with a very low current
  application, we can probably get 
  away with inductors that saturate
  below 250 mA so long as they are
  capable of handling the current. 
  The MLZ2012M100WT000 saturates 
  at 200 mA, and provides a sheild. 
  The CBC2012T100M saturates at
  240mA and provides no shield.

## Library data of the parts
C1 C3 C5 C46 C55 C68 C74 = jonnew:C: Capacitor; PARTNO: CL03A105MP3ZSNH
C2 C4 C6 C12 C13 C26 C70 = jonnew:C: Capacitor; PARTNO: C0603X5R1C104K030BC
C7 C8 C11 C20 C21 = jonnew:C: Capacitor; PARTNO: CL03A104KA3NNNC
C9 C19 C27-C29 C31-C39 C43 C44 C47-C50 C56-C58 C60-C62 C64 C65 C67 C71 C73 = jonnew:C: Capacitor
C10 = jonnew:C: Capacitor; PARTNP: CL03A104KA3NNNC
C14-C16 C23 C54 C69 C75 C76 = jonnew:C: Capacitor; PARTNO: CL05A105KO5NNNC
C17 C18 = jonnew:C: Capacitor; PARTNO: UMK105BJ224KV-F
C22 C24 C42 C77 = jonnew:C: Capacitor; PARTNO: CL05A106MQ5NUNC
C25 = jonnew:C: Capacitor; PARTNO: CL05A475MO5NUNC
C30 = jonnew:C: Capacitor; PARTNO: GRM033R71E103KE14D
C40 C45 C72 = jonnew:C: Capacitor; PARTNO: GRM033R60J474KE90D
C41 = jonnew:C: Capacitor; PARTNO: CL05A226MQ6ZUN8
C51 = jonnew:C: Capacitor; PARTNO: C1005X7R1H104K050BB
C52 = jonnew:C: Capacitor; PARTNO: C1005X7R1H473K050BB
C53 = jonnew:C: Capacitor; PARTNO: CL05A226MQ5QUNC
C59 C63 = jonnew:C: Capacitor; PARTNO: GRM155R61A475MEAAD
C66 = jonnew:C: Capacitor; PARTNO: CL03B103KP3NNNC
D1-D3 = jonnew:PHOTODIODE
D4 = jonnew:S-DIODE: Schottky Diode
D5 D6 = jonnew:LED: Surface mount LED
J1 J2 = jonnew:HEADSTAGE64_EDGE-MOUNT
J3 = jonnew:GND_LINK
L1-L4 L12 = jonnew:L: Inductor
L5-L7 = jonnew:L: Inductor; PARTNO: BLM15PX601SN1D
R1-R40 = jonnew:R: Resistor
TP1-TP12 = jonnew:TP: Test pad
U1 U5 U6 U14 = jonnew:TS4231
U2 = jonnew:MPU9250
U3 = jonnew:CAT4016; PARTNO: CAT4016HV6-GT2
U4 = jonnew:OPAMP; PARTNO: OPA170AIDBVR
U7 = jonnew:RHD2164_BGA: Intan Technologies RHD2164 chip
U8 = jonnew:ADG140X; PARTNO: ADG1401BCPZ
U9 U10 U16-U18 = jonnew:TLV707
U11 = jonnew:10M08DC
U12 = jonnew:LT3463
U13 = jonnew:DAC5311
U15 = jonnew:INSTRUMENTAMP; PARTNO: INA826AIDRGR
U19 = jonnew:DS90UB913A
U25 = jonnew:TPL0501; PARTNO: TPL0501-100RSER
U$1 = jonnew:PINHD-2X35+4
X1 = jonnew:COAX: COAX CONNECTOR - Edge mount BNC - Vertical BNC - Vertical SMA - etc

## Net classes
1 thick: width 0.102 mm